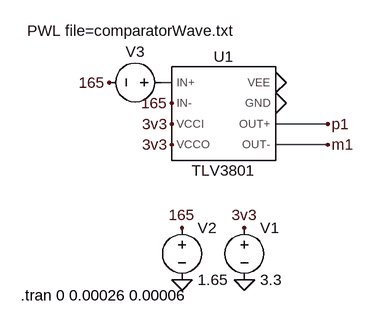
[diagram p0: schematic Comparator.asc]
Comparator.asc, the LTspice schematic file:
Version 4.1
SHEET 1 880 680
WIRE 160 112 144 112
WIRE 400 176 320 176
WIRE 400 208 320 208
FLAG 320 144 0
FLAG 320 112 0
FLAG 272 416 0
FLAG 176 416 0
FLAG 176 336 165
FLAG 272 336 3v3
FLAG 160 176 3v3
FLAG 160 208 3v3
FLAG 400 176 p1
FLAG 400 208 m1
FLAG 160 144 165
FLAG 64 112 165
SYMBOL LTSpiceModels\\snom740a\\TLV3801v3\\TLV3801 240 160 R0
SYMATTR InstName U1
SYMBOL voltage 272 320 R0
WINDOW 123 0 0 Left 0
WINDOW 39 0 0 Left 0
SYMATTR InstName V1
SYMATTR Value 3.3
SYMBOL voltage 176 320 R0
WINDOW 123 0 0 Left 0
WINDOW 39 0 0 Left 0
SYMATTR InstName V2
SYMATTR Value 1.65
SYMBOL voltage 160 112 R90
WINDOW 0 -32 56 VBottom 2
WINDOW 3 -95 62 VTop 2
WINDOW 123 0 0 Left 0
WINDOW 39 0 0 Left 0
SYMATTR InstName V3
SYMATTR Value PWL file=comparatorWave.txt
TEXT -72 440 Left 2 !.tran 0 0.00026 0.00006

The netlist it stands for:
* Comparator.asc
X§U1 N001 165 3v3 3v3 0 0 p1 m1 TLV3801  ; pins IN+ IN- VCCI VCCO VEE GND OUT+ OUT-
V1 3v3 0 3.3
V2 165 0 1.65
V3 N001 165 PWL file=comparatorWave.txt
.tran 0 0.00026 0.00006
.lib C:\Users\jpulu\OneDrive\Área de Trabalho\TCC\LTSpiceModels\snom740a\TLV3801v3\tlv3801.lib
.backanno
.end